# Altium schematic sheet AT Guard Simple Memory.SchDoc
size A4
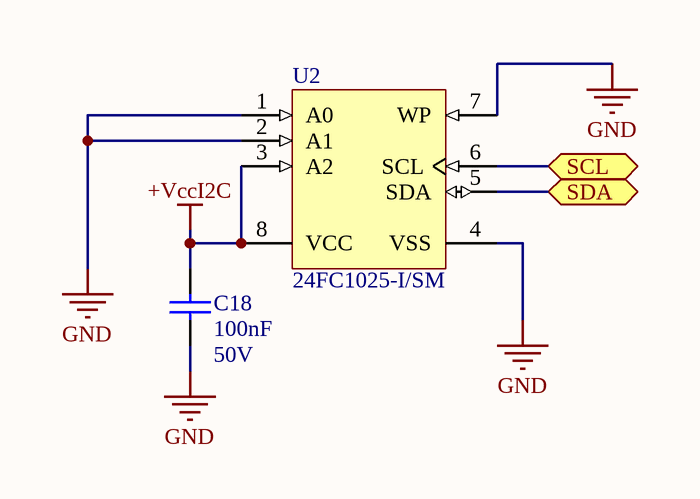
[diagram p0: AT Guard Simple Memory.SchDoc]

## Parts
C18  value 100nF  Voltage: 50V  [3-0603_L]  (hidden comment: Cap)
U2  24FC1025-I/SM  [SOIJ-SM8_N]

## Ports
SCL (bidir), SDA (bidir)

## Nets
+VccI2C: C18.2 U2.3(A2) U2.8(VCC)
GND: C18.1 U2.1(A0) U2.2(A1) U2.4(VSS) U2.7(WP)
SCL: U2.6(SCL) ; port SCL
SDA: U2.5(SDA) ; port SDA

## Library data of the parts
C18 = Cap: Capacitor; Published: 8-Jun-2000; Revision: July-2002: Re-released for DXP Platform.; Publisher: Altium Limited
U2 = 24FC1025-I/SM: 1 Mbit, 1MHz, 2.5V, I2C Serial EEPROM, 8-Pin SOIC 208mil, Industrial Temperature; Published: 29-Jan-2009; DatasheetVersion: revE, Mar-2007; PackageVersion: revAW, Oct-2008; PackageReference: SOIJ-SM8; Publisher: Altium Limited; PackageDescription: 8-Lead Plastic Small Outline (SM) - Medium, 5.28 mm Body [SOIJ]; ComponentLink1Description: Manufacturer Link; ComponentLink1URL: http://www.microchip.com; ComponentLink2Description: Datasheet; ComponentLink2URL: http://ww1.microchip.com/downloads/en/DeviceDoc/21941E.pdf; ComponentLink3Description: Packaging Specification; ComponentLink3URL: http://ww1.microchip.com/downloads/en/PackagingSpec/00049AW.pdf